# EAGLE design NeoSevenSegment (EAGLE 9.2.0)
DATE: LAST_DATE_TIME; REV: 2; TITLE: Neo7Segment
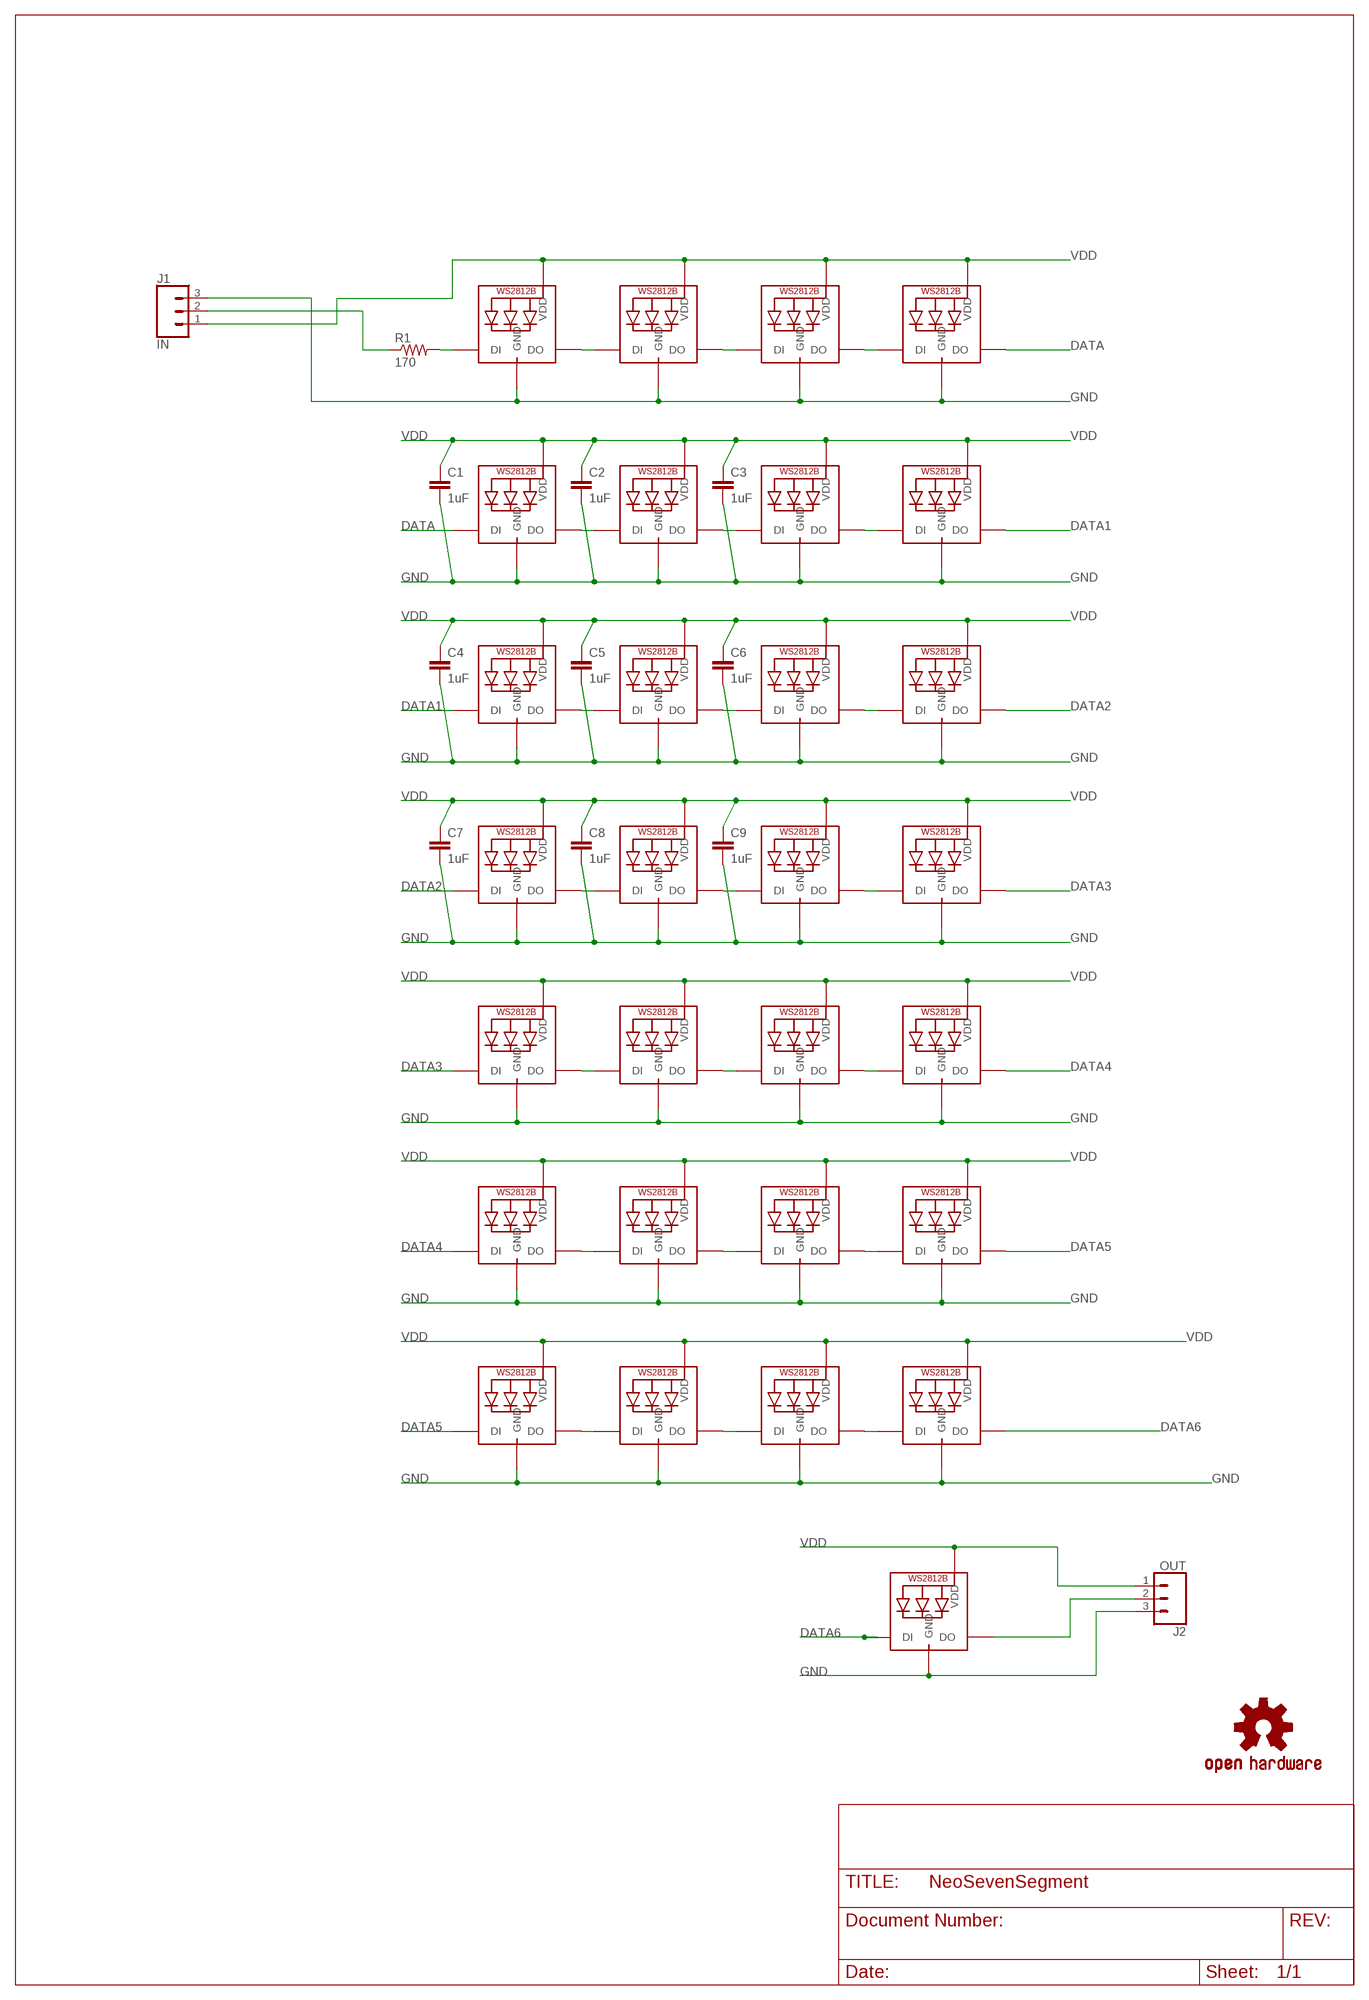
[diagram p0: schematic, sheet 1]

## Parts
C1  1uF  C-EUC1210  [C1210]
C2  1uF  C-EUC1210  [C1210]
C3  1uF  C-EUC1210  [C1210]
C4  1uF  C-EUC1210  [C1210]
C5  1uF  C-EUC1210  [C1210]
C6  1uF  C-EUC1210  [C1210]
C7  1uF  C-EUC1210  [C1210]
C8  1uF  C-EUC1210  [C1210]
C9  1uF  C-EUC1210  [C1210]
J1  IN  CONN_03LONGPADS  [1X03_LONGPADS]
J2  OUT  CONN_03LONGPADS  [1X03_LONGPADS]
LED1  WS2812B_5050N  [WS2812B-NARROW]
LED2  WS2812B_5050N  [WS2812B-NARROW]
LED3  WS2812B_5050N  [WS2812B-NARROW]
LED4  WS2812B_5050N  [WS2812B-NARROW]
LED5  WS2812B_5050N  [WS2812B-NARROW]
LED6  WS2812B_5050N  [WS2812B-NARROW]
LED7  WS2812B_5050N  [WS2812B-NARROW]
LED8  WS2812B_5050N  [WS2812B-NARROW]
LED9  WS2812B_5050N  [WS2812B-NARROW]
LED10  WS2812B_5050N  [WS2812B-NARROW]
LED11  WS2812B_5050N  [WS2812B-NARROW]
LED12  WS2812B_5050N  [WS2812B-NARROW]
LED13  WS2812B_5050N  [WS2812B-NARROW]
LED14  WS2812B_5050N  [WS2812B-NARROW]
LED15  WS2812B_5050N  [WS2812B-NARROW]
LED16  WS2812B_5050N  [WS2812B-NARROW]
LED17  WS2812B_5050N  [WS2812B-NARROW]
LED18  WS2812B_5050N  [WS2812B-NARROW]
LED19  WS2812B_5050N  [WS2812B-NARROW]
LED20  WS2812B_5050N  [WS2812B-NARROW]
LED21  WS2812B_5050N  [WS2812B-NARROW]
LED22  WS2812B_5050N  [WS2812B-NARROW]
LED23  WS2812B_5050N  [WS2812B-NARROW]
LED24  WS2812B_5050N  [WS2812B-NARROW]
LED25  WS2812B_5050N  [WS2812B-NARROW]
LED26  WS2812B_5050N  [WS2812B-NARROW]
LED27  WS2812B_5050N  [WS2812B-NARROW]
LED28  WS2812B_5050N  [WS2812B-NARROW]
LED29  WS2812B_5050N  [WS2812B-NARROW]
LOGO1  OSHW-LOGOM  [OSHW-LOGO-M]
R1  170  R-US_R1206  [R1206]

## Nets
DATA: LED4.2-DOUT(DO) LED5.4-DIN(DI)
DATA1: LED8.2-DOUT(DO) LED9.4-DIN(DI)
DATA2: LED12.2-DOUT(DO) LED13.4-DIN(DI)
DATA3: LED16.2-DOUT(DO) LED17.4-DIN(DI)
DATA4: LED20.2-DOUT(DO) LED21.4-DIN(DI)
DATA5: LED24.2-DOUT(DO) LED25.4-DIN(DI)
DATA6: LED28.2-DOUT(DO) LED29.4-DIN(DI)
DATA_OUT: J2.2 LED29.2-DOUT(DO)
DI: J1.2 R1.1
DI_R: LED1.4-DIN(DI) R1.2
GND: C1.2 C2.2 C3.2 C4.2 C5.2 C6.2 C7.2 C8.2 C9.2 J1.3 J2.3 LED1.3-GND(GND) LED2.3-GND(GND) LED3.3-GND(GND) LED4.3-GND(GND) LED5.3-GND(GND) LED6.3-GND(GND) LED7.3-GND(GND) LED8.3-GND(GND) LED9.3-GND(GND) LED10.3-GND(GND) LED11.3-GND(GND) LED12.3-GND(GND) LED13.3-GND(GND) LED14.3-GND(GND) LED15.3-GND(GND) LED16.3-GND(GND) LED17.3-GND(GND) LED18.3-GND(GND) LED19.3-GND(GND) LED20.3-GND(GND) LED21.3-GND(GND) LED22.3-GND(GND) LED23.3-GND(GND) LED24.3-GND(GND) LED25.3-GND(GND) LED26.3-GND(GND) LED27.3-GND(GND) LED28.3-GND(GND) LED29.3-GND(GND)
N$25: LED9.2-DOUT(DO) LED10.4-DIN(DI)
N$27: LED10.2-DOUT(DO) LED11.4-DIN(DI)
N$28: LED11.2-DOUT(DO) LED12.4-DIN(DI)
N$29: LED1.2-DOUT(DO) LED2.4-DIN(DI)
N$30: LED2.2-DOUT(DO) LED3.4-DIN(DI)
N$31: LED3.2-DOUT(DO) LED4.4-DIN(DI)
N$32: LED13.2-DOUT(DO) LED14.4-DIN(DI)
N$33: LED14.2-DOUT(DO) LED15.4-DIN(DI)
N$34: LED15.2-DOUT(DO) LED16.4-DIN(DI)
N$35: LED17.2-DOUT(DO) LED18.4-DIN(DI)
N$36: LED18.2-DOUT(DO) LED19.4-DIN(DI)
N$37: LED5.2-DOUT(DO) LED6.4-DIN(DI)
N$38: LED6.2-DOUT(DO) LED7.4-DIN(DI)
N$39: LED7.2-DOUT(DO) LED8.4-DIN(DI)
N$40: LED19.2-DOUT(DO) LED20.4-DIN(DI)
N$41: LED21.2-DOUT(DO) LED22.4-DIN(DI)
N$42: LED22.2-DOUT(DO) LED23.4-DIN(DI)
N$43: LED23.2-DOUT(DO) LED24.4-DIN(DI)
S1: LED25.2-DOUT(DO) LED26.4-DIN(DI)
S2: LED26.2-DOUT(DO) LED27.4-DIN(DI)
S3: LED27.2-DOUT(DO) LED28.4-DIN(DI)
VDD: C1.1 C2.1 C3.1 C4.1 C5.1 C6.1 C7.1 C8.1 C9.1 J1.1 J2.1 LED1.1-VDD(VDD) LED2.1-VDD(VDD) LED3.1-VDD(VDD) LED4.1-VDD(VDD) LED5.1-VDD(VDD) LED6.1-VDD(VDD) LED7.1-VDD(VDD) LED8.1-VDD(VDD) LED9.1-VDD(VDD) LED10.1-VDD(VDD) LED11.1-VDD(VDD) LED12.1-VDD(VDD) LED13.1-VDD(VDD) LED14.1-VDD(VDD) LED15.1-VDD(VDD) LED16.1-VDD(VDD) LED17.1-VDD(VDD) LED18.1-VDD(VDD) LED19.1-VDD(VDD) LED20.1-VDD(VDD) LED21.1-VDD(VDD) LED22.1-VDD(VDD) LED23.1-VDD(VDD) LED24.1-VDD(VDD) LED25.1-VDD(VDD) LED26.1-VDD(VDD) LED27.1-VDD(VDD) LED28.1-VDD(VDD) LED29.1-VDD(VDD)

## Library data of the parts
C1-C9 = rcl:C-EU: CAPACITOR, European symbol
J1 J2 = SparkFun-Connectors:CONN_03: Multi connection point. Often used as Generic Header-pin footprint for 0.1 inch spaced/style header connections On any of the 0.1 inch spaced packages, you can populate with these: Break Away Headers - Straight <https://www.sparkfun.com/products/116> (PRT-00116) Break Away Male Headers - Right Angle <https://www.sparkfun.com/products/553> (PRT-00553) Female Headers <https://www.sparkfun.com/products/115> (PRT-00115) Break Away Headers - Machine Pin <https://www.sparkfun.com/products/117> (PRT-00117) Break Away Female Headers - Swiss Machine Pin <https://www.sparkfun.com/products/743> (PRT-00743) Stackable Header - 3 Pin (Female, 0.1") <https://www.sparkfun.com/products/13875> (PRT-13875) For SCREWTERMINALS and SPRING TERMINALS visit here: Screw Terimnals on SparkFun.com <https://www.sparkfun.com/search/results?term=Screw+Terminals> (5mm/3.5mm/2.54mm spacing) This device is also useful as a general connection point to wire up your design to another part of your project. Our various solder wires solder well into these plated through hole pads. Hook-Up Wire - Assortment (Stranded, 22 AWG) <https://www.sparkfun.com/products/11375> (PRT-11375) Hook-Up Wire - Assortment (Solid Core, 22 AWG) <https://www.sparkfun.com/products/11367> (PRT-11367) View the entire wire category on our website here <https://www.sparkfun.com/categories/141> Special notes: Molex polarized connector foot print use with SKU : PRT-08232 with associated crimp pins and housings.
LED1-LED29 = adafruit:WS2812B
LOGO1 = SparkFun-Aesthetics:OSHW-LOGO: Open-Source Hardware (OSHW) Logo This logo indicates the piece of hardware it is found on incorporates a OSHW license and/or adheres to the definition of open source hardware found here: http://freedomdefined.org/OSHW
R1 = rcl:R-US_: RESISTOR, American symbol; SPICEPREFIX: R

## Net classes
0 default: width 0.203 mm, drill 0.483 mm, clearance 0.102 mm

## Board
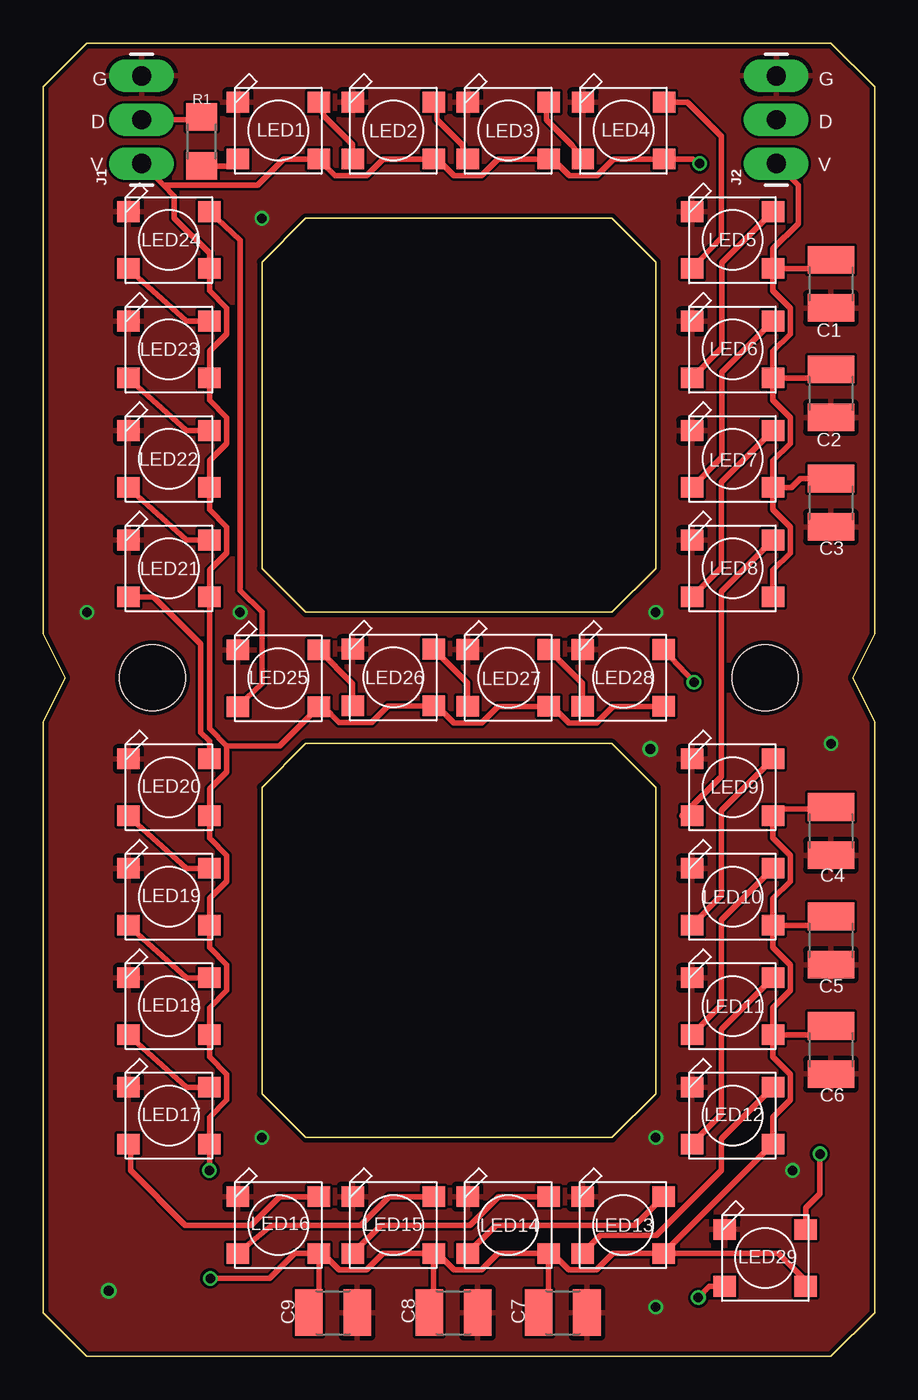
[diagram p1: board, top side]
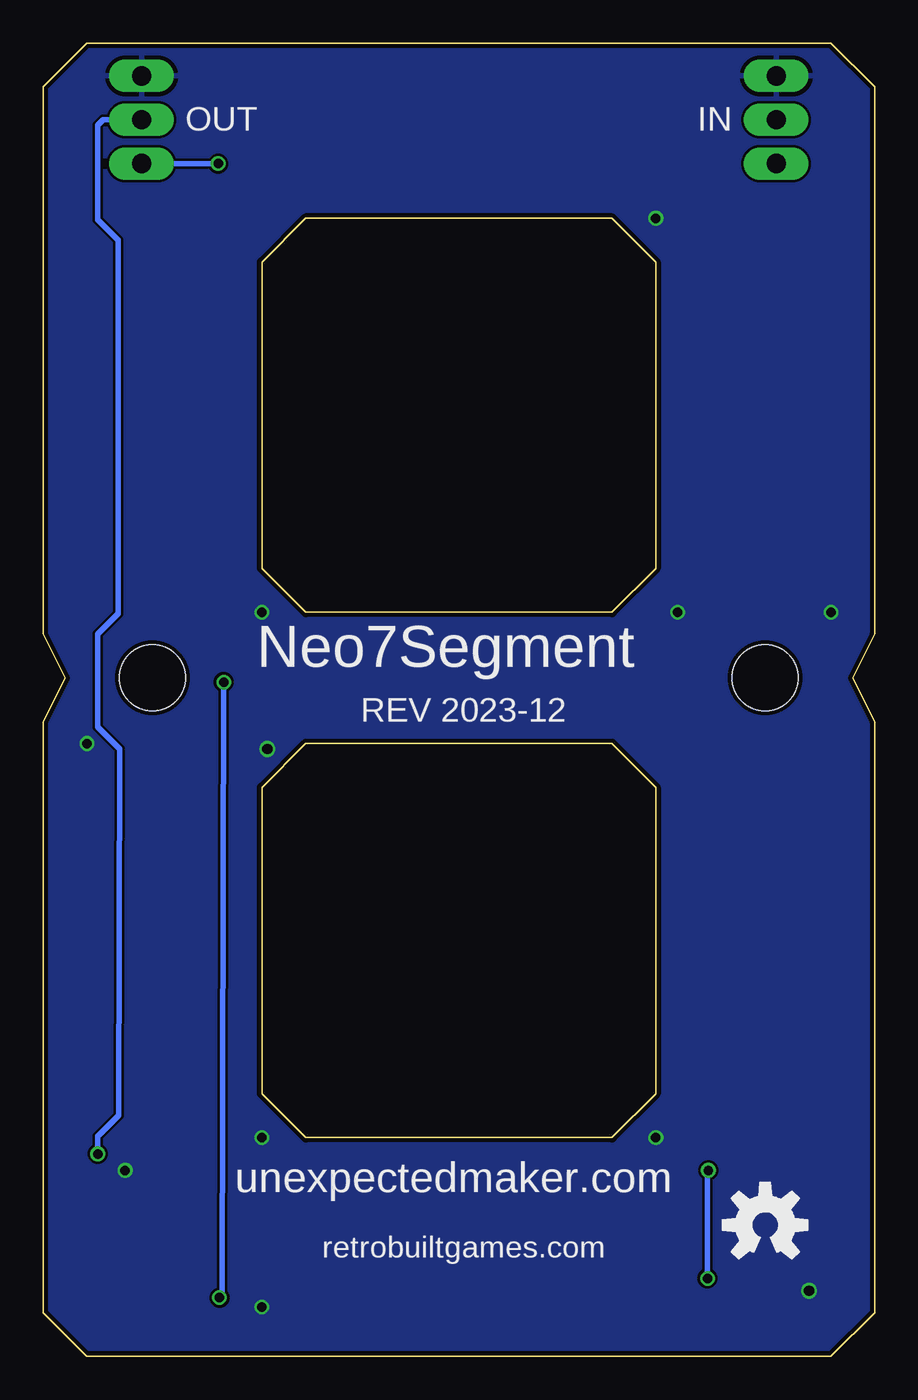
[diagram p2: board, bottom side, seen from below]

Size 48.26 x 76.2 mm. Coordinates in mm from the lower left corner, seen from the top.
Outline: 0,73.66 0,41.91 1.27,39.37 0,36.83 0,2.54 2.54,0 45.72,0 48.26,2.54 48.26,36.83 46.99,39.37 48.26,41.91 48.26,73.66 45.72,76.2 2.54,76.2 0,73.66
Outline: 15.24,43.18 33.02,43.18 35.56,45.72 35.56,63.5 33.02,66.04 15.24,66.04 12.7,63.5 12.7,45.72 15.24,43.18
Outline: 15.24,35.56 12.7,33.02 12.7,15.24 15.24,12.7 33.02,12.7 35.56,15.24 35.56,33.02 33.02,35.56 15.24,35.56
Copper layers (1*16): Top 0.035mm / dielectric 1.5mm / Bottom 0.035mm
Design rules "SeeedStudio_2layer_DRU_no_angle_20140221 *": minimum track width 6mil, minimum drill 12mil, track to track 6mil, track to pad 6mil, pad to pad 6mil, via to via 6mil, smd to smd 0mil, copper to edge 10mil, drill to drill 10mil, minimum pad ring 10mil, minimum via ring 6mil, stop-mask expansion 2mil, vias tented up to drill 100mil, thermal gap 10mil
Holes 3.81 mm at 6.35,39.37 41.91,39.37

### Footprints (pad centres in the part's own frame; a part is rotated, then mirrored left to right if it is on the bottom)
C1210 = smd 1.6 x 2.7: 1 -1.4,0; 2 1.4,0
1X03_LONGPADS = drill 1.118 pad 1.88 long: 1 0,0; 2 2.54,0; 3 5.08,0
WS2812B-NARROW = smd 1.3 x 1.2: 1-VDD 2.35,-1.65; 2-DOUT 2.35,1.65; 3-GND -2.35,1.65; 4-DIN -2.35,-1.65
R1206 = smd 1.6 x 1.803: 1 -1.422,0; 2 1.422,0

### Placement (x,y rotation side)
C1  45.72,62.23 270 top
C2  45.72,55.88 270 top
C3  45.72,49.53 270 top
C4  45.72,30.48 270 top
C5  45.72,24.13 270 top
C6  45.72,17.78 270 top
C7  30.16,2.54 0 top
C8  23.81,2.54 0 top
C9  16.83,2.54 0 top
J1  5.71,69.22 90 top
J2  42.54,69.22 90 top
LED1  13.65,71.12 0 top
LED2  20.32,71.12 0 top
LED3  26.99,71.12 0 top
LED4  33.68,71.12 0 top
LED5  40,64.77 0 top
LED6  40,58.42 0 top
LED7  40,52.07 0 top
LED8  40,45.72 0 top
LED9  40,33.02 0 top
LED10  40,26.67 0 top
LED11  40,20.32 0 top
LED12  40,13.97 0 top
LED13  33.66,7.62 0 top
LED14  26.99,7.62 0 top
LED15  20.32,7.62 0 top
LED16  13.65,7.62 0 top
LED17  7.3,13.97 0 top
LED18  7.3,20.32 0 top
LED19  7.3,26.67 0 top
LED20  7.3,33.02 0 top
LED21  7.3,45.72 0 top
LED22  7.3,52.07 0 top
LED23  7.3,58.42 0 top
LED24  7.3,64.77 0 top
LED25  13.65,39.34 0 top
LED26  20.32,39.4 0 top
LED27  26.99,39.37 0 top
LED28  33.66,39.37 0 top
LED29  41.91,5.71 0 top
LOGO1  6.35,7.62 0 bottom
R1  9.21,70.48 270 top

### Tracks (layer width: path | path; a pad name or v marks a point on that pad's centre or on a via)
DATA
  Top 0.305: LED5.4-DIN 39.37,64.9 39.37,67.31 39.37,67.94 39.37,70.8 37.4,72.77 LED4.2-DOUT
DATA1
  Top 0.305: LED9.4-DIN 37.09,31.37 39.37,33.66 39.37,44.38 LED8.2-DOUT
DATA2
  Top 0.305: LED12.2-DOUT 39.37,12.63 39.37,10.79 35.59,7.02 32.35,7.02 LED13.4-DIN
DATA3
  Top 0.305: LED16.2-DOUT 13.71,9.27 12.06,7.62 8.25,7.62 5.08,10.79 5.08,12.19 LED17.4-DIN
DATA4
  Top 0.305: LED21.4-DIN 6.41,44.07 9.14,41.34 9.14,36.21 9.65,35.7 LED20.2-DOUT
DATA5
  Top 0.305: LED24.2-DOUT 11.43,64.77 11.43,44.45 12.7,43.18 12.7,39.05 LED25.4-DIN
DATA6  (via drill 0.55)
  Top 0.305: LED28.2-DOUT v37.77,39.12 | v38.02,3.41 38.67,4.06 LED29.4-DIN
  Bottom 0.305: v38.02,3.41 37.88,3.56 v37.77,39.12
DATA_OUT  (via drill 0.55)
  Top 0.305: v45.09,11.75 45.09,9.45 44.26,8.62 LED29.2-DOUT
  Bottom 0.305: J2.2 44.77,71.75 45.09,71.44 45.09,65.96 43.89,64.77 43.89,43.1 45.09,41.91 45.09,36.51 43.81,35.24 43.89,13.97 45.09,12.78 v45.09,11.75
DI
  Top 0.305: J1.2 9.06,71.75 R1.1
DI_R
  Top 0.305: LED1.4-DIN 11.24,69.53 10.76,69.06 R1.2
GND  (via drill 0.55, 0.6)
  other vias: 12.7,12.7 35.56,12.7 35.24,35.24 35.56,43.18 2.54,43.18 45.72,35.56 3.81,3.81 11.43,43.18 35.56,2.86 12.7,66.04 43.5,10.79
  pour Top: -1.27,78.74 -1.27,-1.27 52.07,-1.27 52.07,78.74
  pour Bottom: -2.54,80.01 53.34,80.01 53.34,-3.81 -2.54,-3.81
N$25
  Top 0.305: LED10.4-DIN 39.37,26.73 39.37,31.69 LED9.2-DOUT
N$27
  Top 0.305: LED10.2-DOUT 39.37,25.34 39.37,20.38 LED11.4-DIN
N$28
  Top 0.305: LED11.2-DOUT 39.37,18.98 39.37,14.03 LED12.4-DIN
N$29
  Top 0.305: LED1.2-DOUT 16.32,71.94 17.97,70.3 LED2.4-DIN
N$30
  Top 0.305: LED2.2-DOUT 22.86,72.58 22.86,71.75 24.32,70.3 LED3.4-DIN
N$31
  Top 0.305: LED3.2-DOUT 29.21,72.58 29.21,71.75 30.7,70.27 LED4.4-DIN
N$32
  Top 0.305: LED14.4-DIN 26.29,7.62 34.35,7.62 LED13.2-DOUT
N$33
  Top 0.305: LED14.2-DOUT 26.42,9.27 24.77,7.62 19.62,7.62 LED15.4-DIN
N$34
  Top 0.305: LED15.2-DOUT 20.07,9.27 18.42,7.62 13.27,7.62 LED16.4-DIN
N$35
  Top 0.305: LED17.2-DOUT 8.32,15.62 LED18.4-DIN
N$36
  Top 0.305: LED18.2-DOUT 8.32,21.97 LED19.4-DIN
N$37
  Top 0.305: LED5.2-DOUT 39.4,63.47 39.4,58.52 LED6.4-DIN
N$38
  Top 0.305: LED6.2-DOUT 39.4,57.12 39.4,52.17 LED7.4-DIN
N$39
  Top 0.305: LED7.2-DOUT 39.37,50.73 39.37,45.78 LED8.4-DIN
N$40
  Top 0.305: LED19.2-DOUT 8.32,28.32 LED20.4-DIN
N$41
  Top 0.305: LED21.2-DOUT 8.32,47.37 LED22.4-DIN
N$42
  Top 0.305: LED22.2-DOUT 8.32,53.72 LED23.4-DIN
N$43
  Top 0.305: LED23.2-DOUT 8.32,60.07 LED24.4-DIN
S1
  Top 0.305: LED25.2-DOUT 17.97,39.03 LED26.4-DIN
S2
  Top 0.305: LED26.2-DOUT 24.64,39.08 LED27.4-DIN
S3
  Top 0.305: LED27.2-DOUT 31.31,39.05 LED28.4-DIN
VDD  (via drill 0.55)
  Top 0.305: LED16.1-VDD 14.6,5.97 13.16,4.52 v9.7,4.52 | LED5.1-VDD 42.35,61.82 43.36,60.82 43.36,59.32 42.35,58.32 LED6.1-VDD | LED6.1-VDD 42.35,55.47 43.36,54.47 43.36,52.97 42.35,51.97 LED7.1-VDD | LED7.1-VDD 42.35,49.12 43.36,48.12 43.36,46.62 42.35,45.62 LED8.1-VDD | 10.66,35.42 10.66,33.92 9.65,32.92 LED20.1-VDD 9.65,30.07 10.66,29.07 10.66,27.57 9.65,26.57 LED19.1-VDD 9.65,23.72 10.66,22.72 10.66,21.22 9.65,20.22 LED18.1-VDD 9.65,17.37 10.66,16.37 10.66,14.87 9.65,13.87 LED17.1-VDD v9.65,10.79 | 10.66,35.42 9.65,36.42 LED21.1-VDD 9.65,45.62 10.66,46.62 10.66,48.12 9.65,49.12 LED22.1-VDD 9.65,51.97 10.66,52.97 10.66,54.47 9.65,55.47 LED23.1-VDD 9.65,58.32 10.66,59.32 10.66,60.82 9.65,61.82 LED24.1-VDD 9.65,64.01 7.62,66.04 7.62,67.31 6.98,67.94 | LED10.1-VDD 42.35,26.57 43.36,27.57 43.36,29.07 42.35,30.07 LED9.1-VDD 42.73,31.75 45.72,31.75 C4.1 | LED10.1-VDD 42.35,23.72 43.36,22.72 43.36,21.22 42.35,20.22 LED11.1-VDD | LED11.1-VDD 42.35,17.37 43.36,16.37 43.36,14.87 42.35,13.87 LED12.1-VDD LED13.1-VDD | LED13.1-VDD 33.06,5.97 32.1,5.01 30.51,5.01 29.55,5.97 LED14.1-VDD | LED15.1-VDD 22.89,5.97 23.84,5.01 25.44,5.01 26.39,5.97 LED14.1-VDD | LED16.1-VDD 16.22,5.97 17.17,5.01 18.77,5.01 19.72,5.97 LED15.1-VDD | LED28.1-VDD 33.06,37.72 32.1,36.76 30.51,36.76 29.55,37.72 LED27.1-VDD 26.39,37.72 25.44,36.76 23.84,36.76 22.86,37.75 LED26.1-VDD 20.01,37.75 19.05,36.79 17.17,36.79 16.27,37.69 LED25.1-VDD 13.72,35.42 10.66,35.42 | J1.1 6.98,67.94 | 6.98,67.94 12.44,67.94 13.97,69.47 LED1.1-VDD 16.96,68.51 18.77,68.51 19.72,69.47 LED2.1-VDD 22.89,69.47 23.84,68.51 25.44,68.51 26.39,69.47 LED3.1-VDD 29.58,69.47 30.53,68.51 32.13,68.51 33.08,69.47 LED4.1-VDD 37.72,69.47 v38.1,69.22
  Top 0.305: LED5.1-VDD 42.35,64.26 43.81,65.72 43.81,67.94 J2.1 | LED13.1-VDD 42.67,5.97 44.2,4.45 44.22,4.45 44.26,4.4 LED29.1-VDD | C8.1 22.67,2.8 LED15.1-VDD | C3.1 43.95,50.93 43.43,50.42 LED7.1-VDD | LED5.1-VDD 45.21,63.12 C1.1 | LED6.1-VDD 45.21,56.77 C2.1 | LED10.1-VDD 45.21,25.02 C5.1 | LED16.1-VDD 16,3.11 C9.1 | LED11.1-VDD 45.21,18.67 C6.1 | LED14.1-VDD 29.34,3.11 C7.1
  Bottom 0.305: v9.7,4.52 9.7,10.74 v9.65,10.79 | v38.1,69.22 J2.1

### Text on the board
tPlace: G | G | D | D | V | V
bPlace: IN | OUT | Neo7Segment | REV 2023-12 | unexpectedmaker.com | retrobuiltgames.com